# Altium schematic sheet NMT_CPU51.SCHDOC
size A4; Organization: Altium Limited; Address1: L3, 12a Rodborough Rd; Address2: Frenchs Forest; Address3: NSW; Address4: Australia 2086; DocumentNumber: 13; SheetNumber: 1; SheetTotal: 13
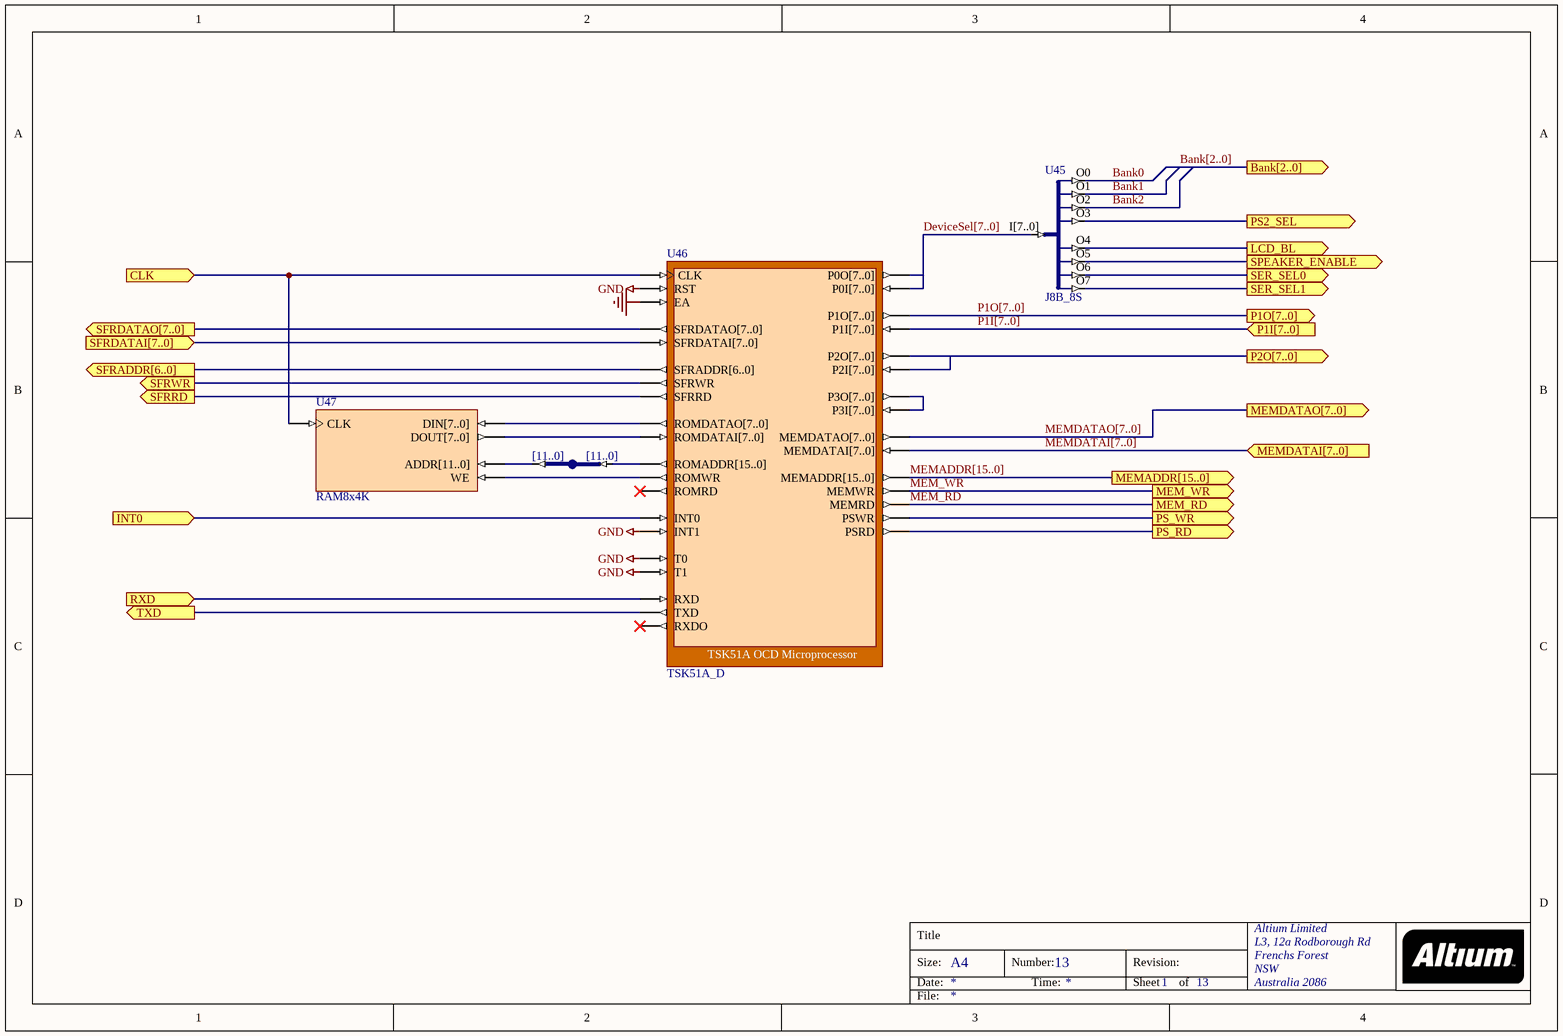
[diagram p0: NMT_CPU51.SCHDOC]

## Parts
JB_S2  IndexA: [11..0]  (hidden comment: JB)
U45  J8B_8S
U46  TSK51A_D
U47  RAM8x4K

## Ports
Bank[2..0] (out), CLK (in), INT0 (in), LCD_BL (out), MEM_RD (out), MEM_WR (out), MEMADDR[15..0] (out), MEMDATAI[7..0] (in), MEMDATAO[7..0] (out), P1I[7..0] (in), P1O[7..0] (out), P2O[7..0] (out), PS2_SEL (out), PS_RD (out), PS_WR (out), RXD (in), SER_SEL0 (out), SER_SEL1 (out), SFRADDR[6..0] (out), SFRDATAI[7..0] (in), SFRDATAO[7..0] (out), SFRRD (out), SFRWR (out), SPEAKER_ENABLE (out), TXD (out)

## Nets
GND: U46.EA U46.INT1 U46.RST U46.T0 U46.T1
Bank0: U45.O0
Bank1: U45.O1
Bank2: U45.O2
CLK: U46.CLK U47.CLK ; port CLK
DeviceSel[7..0]: U45.I[7..0] U46.P0I[7..0] U46.P0O[7..0]
INT0: U46.INT0 ; port INT0
LCD_BL: U45.O4 ; port LCD_BL
MEM_RD: U46.MEMRD ; port MEM_RD
MEM_WR: U46.MEMWR ; port MEM_WR
MEMADDR[15..0]: U46.MEMADDR[15..0] ; port MEMADDR[15..0]
MEMDATAI[7..0]: U46.MEMDATAI[7..0] ; port MEMDATAI[7..0]
MEMDATAO[7..0]: U46.MEMDATAO[7..0] ; port MEMDATAO[7..0]
P1I[7..0]: U46.P1I[7..0] ; port P1I[7..0]
P1O[7..0]: U46.P1O[7..0] ; port P1O[7..0]
P2O[7..0]: U46.P2I[7..0] U46.P2O[7..0] ; port P2O[7..0]
PS2_SEL: U45.O3 ; port PS2_SEL
PS_RD: U46.PSRD ; port PS_RD
PS_WR: U46.PSWR ; port PS_WR
RXD: U46.RXD ; port RXD
SER_SEL0: U45.O6 ; port SER_SEL0
SER_SEL1: U45.O7 ; port SER_SEL1
SFRADDR[6..0]: U46.SFRADDR[6..0] ; port SFRADDR[6..0]
SFRDATAI[7..0]: U46.SFRDATAI[7..0] ; port SFRDATAI[7..0]
SFRDATAO[7..0]: U46.SFRDATAO[7..0] ; port SFRDATAO[7..0]
SFRRD: U46.SFRRD ; port SFRRD
SFRWR: U46.SFRWR ; port SFRWR
SPEAKER_ENABLE: U45.O5 ; port SPEAKER_ENABLE
TXD: U46.TXD ; port TXD
NetJB_S2_A[0..0]: JB_S2.A[0..0](IA[0..0]) U47.ADDR[11..0]
NetJB_S2_B[0..0]: JB_S2.B[0..0] U46.ROMADDR[15..0]
NetU46_P3I[7..0]: U46.P3I[7..0] U46.P3O[7..0]
NetU46_ROMDATAI[7..0]: U46.ROMDATAI[7..0] U47.DOUT[7..0]
NetU46_ROMDATAO[7..0]: U46.ROMDATAO[7..0] U47.DIN[7..0]
NetU46_ROMWR: U46.ROMWR U47.WE

Not connected (* = marked no-connect by the designer): U46 ROMRD* RXDO*

## Buses and harness runs
bus Bank[2..0] = port Bank[2..0]
bus DeviceSel[7..0]
bus MEMADDR[15..0] = port MEMADDR[15..0]
bus MEMDATAI[7..0] = port MEMDATAI[7..0]
bus MEMDATAO[7..0] = port MEMDATAO[7..0]
bus P1I[7..0] = port P1I[7..0]
bus P1O[7..0] = port P1O[7..0]

## Notes on the sheet
- Title
- Size:
- Date:
- A4
- Number:
- Time:
- Revision:
- Sheet
- of
- File:

## Library data of the parts
JB_S2 = JB: System Joiner; Class I: Bus Joiner; ArchiveName: GENERIC; Published: 18-Sep-2003; Publisher: Altium Limited; IndexB: [11..0]
U45 = J8B_8S: 8-Bit input bus to 8 single pin outputs; ArchiveName: GENERIC; Published: 7-Nov-2003; Publisher: Altium Limited; Core Revision: 1.00.00
U46 = TSK51A_D: TSK51A OCD Microprocessor; NEXUS_CORE: Processor_OCDS; NEXUS_JTAG_DEVICE: True; NEXUS_JTAG_ORDER: 0; ChildModel1: RAM256x8_TSK51D; Memory_Configuration: Record[NEXUS_CORE]{}ComponentDesignator[iram]{}Memory_Depth[256]{}Memory_UsageType[ram]{}ProgramDownloadAddress[0x0]{}Memory_BusType[c51:idata_bus]{n}Record[NEXUS_CORE]{}ComponentDesignator[xram]{}Memory_Depth[1]{}Memory_UsageType[ram]{}ProgramDownloadAddress[0x0]{}Memory_BusType[c51:xdata_bus]{n}Record[NEXUS_CORE]{}ComponentDesignator[xrom]{}Memory_Depth[4K]{}Memory_UsageType[rom]{}ProgramDownloadAddress[0]{}Memory_BusType[c51:code_bus]{n}; Published: 10/11/2003; Publisher: Altium Hobart Technology Centre; Core Revision: 1.00.00
U47 = RAM8x4K: Single Port Random Access Memory 4096 x 8; Memory_Depth: 4096; Memory_Type: RAM_SinglePortBlock; Memory_Width: 8; Memory_ClockEdge: Rising; Nexus_Core: Memory_Program; Published: 26/09/2003; Publisher: Altium Hobart Technology Center